# Altium schematic sheet DS1307.SchDoc
size A
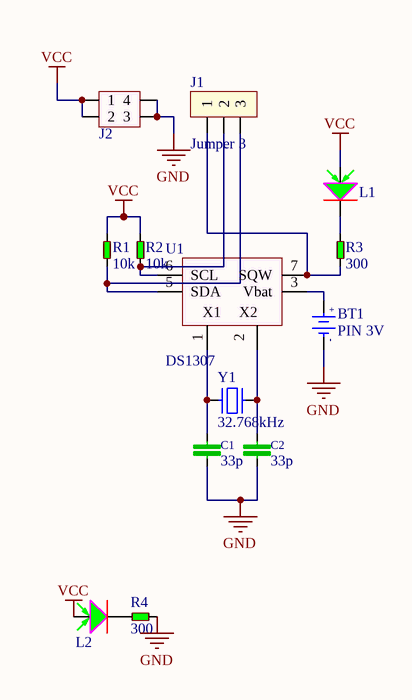
[diagram p0: DS1307.SchDoc]

## Parts
BT1  PIN 3V  [PIN3V]
C1  33p  [C-0805]
C2  33p  [C-0805]
J1  Jumper 3  [JP3]
J2  JP2x2  [JP2-D2T]  (value not drawn)
L1  LED SMD  [L0805B]  (value not drawn)
L2  LED SMD  [L0805R]  (value not drawn)
R1  10k  [R0805]
R2  10k  [R0805]
R3  300  [R0805]
R4  300  [R0805]
U1  DS1307  [DIP8]
Y1  32.768kHz  [XT32k]

## Nets
GND: BT1.2(GND) C1.2 C2.2 J2.3 J2.4 R4.1 U1.4(GND)
VCC: J2.1 J2.2 L1.1(A) L2.1(A) R1.1 R2.1 U1.8(VCC)
NetBT1_1: BT1.1(+3V) U1.3(Vbat)
NetC1_1: C1.1 U1.1(X1) Y1.1
NetC2_1: C2.1 U1.2(X2) Y1.2
NetJ1_1: J1.1 R3.2 U1.7(SQW)
NetJ1_2: J1.2 R2.2 U1.6(SCL)
NetJ1_3: J1.3 R1.2 U1.5(SDA)
NetL1_2: L1.2(K) R3.1
NetL2_2: L2.2(K) R4.2

## Notes on the sheet
- (in symbol PIN 3V) +; -

## Library data of the parts
BT1 = PIN 3V: Lithium Battery Holder for CR2032 3V Cell
C1 C2 = CN: CAP CER 0.047UF 25V X7R 0402
J1 = JP3: Value: J3
J2 = JP2x2: WR-PHD 2.54 mm Dual Socket Header
L1 L2 = LED SMD: LED DIFFUSED 1206 SMD
R1-R4 = Res-SMD: RES SMD 0.0 OHM JUMPER 1/8W 0805
U1 = DS1307: MAXIM INTEGRATED PRODUCTS   DS1307+.   IC, RTC, SERIAL, 64X8, 8DIP
Y1 = XT2: 20MHz ±20ppm Crystal 18pF 40 Ohm -20°C ~ 70°C  Surface Mount HC49/US